# Altium schematic sheet ersa_schematics_analog.SchDoc: Ersa Module Analog
size A3; Author: Tomash Ghz; CompanyName: GHz Labs; DrawnBy: Tomash Ghz; Engineer: Tomash Ghz; Organization: GHz Labs; Address1: Tomash Ghz; Address2: Berlin 2019; Revision: 1.0; SheetNumber: 2; SheetTotal: 2; DocumentName: Ersa Module Analog; ProjectName: Ersa
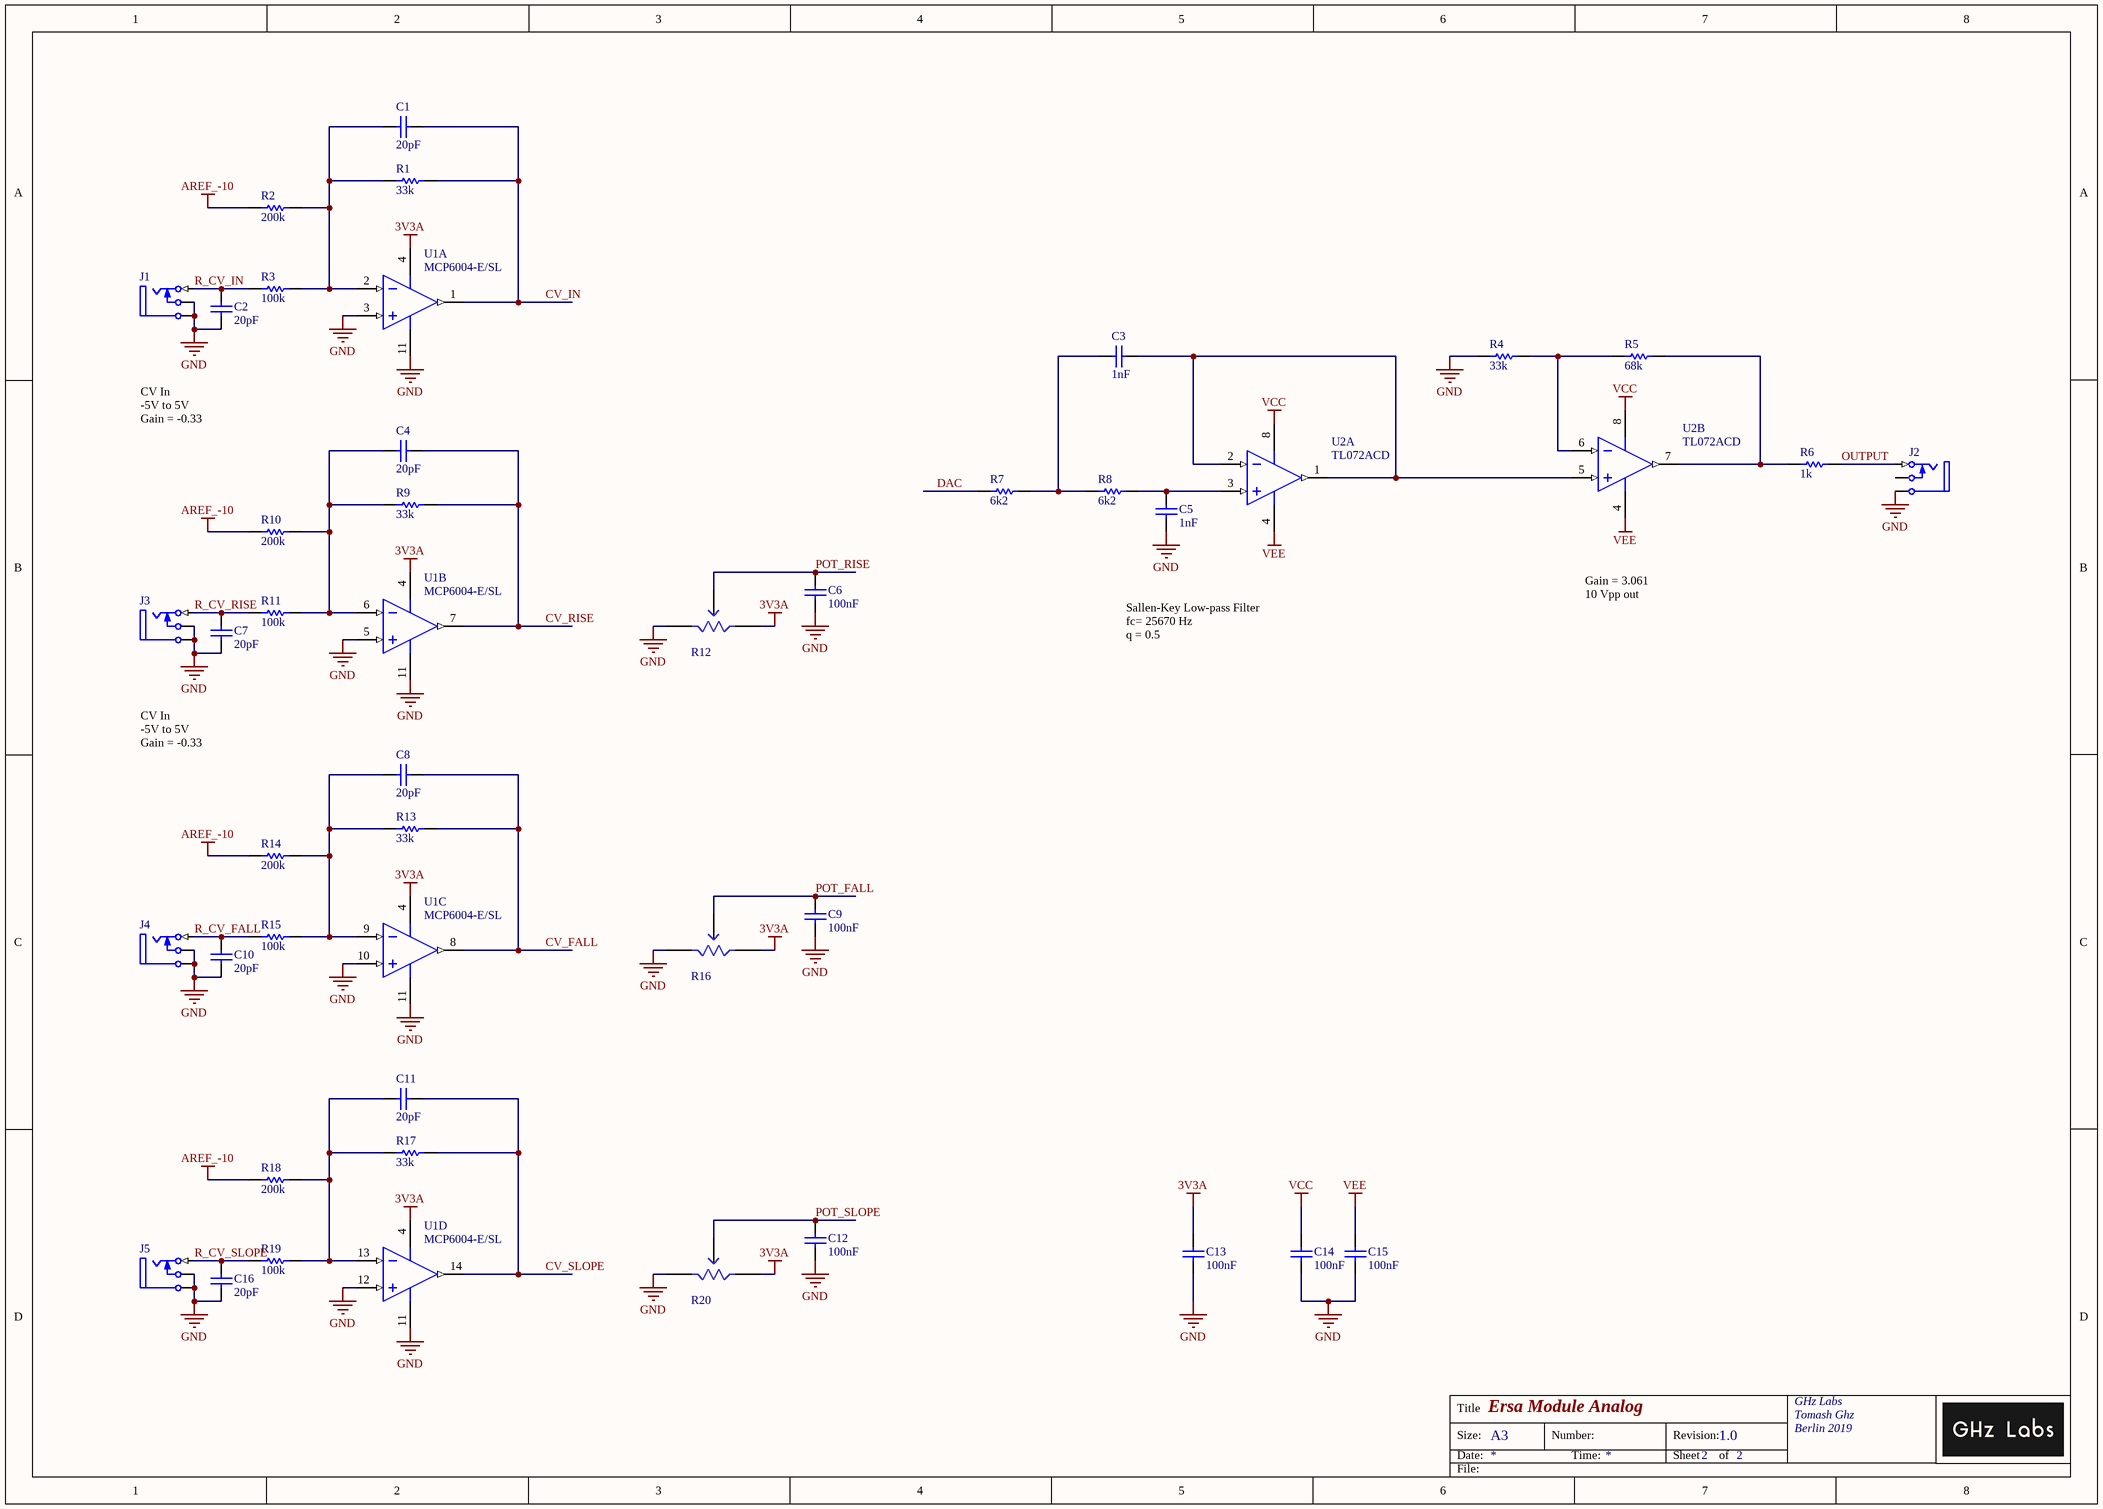
[diagram p0: ersa_schematics_analog.SchDoc]

## Parts
C1  20pF  [CAPA_0805]
C2  20pF  [CAPA_0805]
C3  1nF  [CAPA_0805]
C4  20pF  [CAPA_0805]
C5  1nF  [CAPA_0805]
C6  100nF  [CAPA_0805]
C7  20pF  [CAPA_0805]
C8  20pF  [CAPA_0805]
C9  100nF  [CAPA_0805]
C10  20pF  [CAPA_0805]
C11  20pF  [CAPA_0805]
C12  100nF  [CAPA_0805]
C13  100nF  [CAPA_0805]
C14  100nF  [CAPA_0805]
C15  100nF  [CAPA_0805]
C16  20pF  [CAPA_0805]
J1  Phonejack2 TN  [Thonkiconn]  (value not drawn)
J2  Phonejack2 TN  [Thonkiconn]  (value not drawn)
J3  Phonejack2 TN  [Thonkiconn]  (value not drawn)
J4  Phonejack2 TN  [Thonkiconn]  (value not drawn)
J5  Phonejack2 TN  [Thonkiconn]  (value not drawn)
R1  33k  [RES_0805]
R2  200k  [RES_0805]
R3  100k  [RES_0805]
R4  33k  [RES_0805]
R5  68k  [RES_0805]
R6  1k  [RES_0805]
R7  6k2  [RES_0805]
R8  6k2  [RES_0805]
R9  33k  [RES_0805]
R10  200k  [RES_0805]
R11  100k  [RES_0805]
R12  Potentiometer  [POT-ALPHA]  (value not drawn)
R13  33k  [RES_0805]
R14  200k  [RES_0805]
R15  100k  [RES_0805]
R16  Potentiometer  [POT-ALPHA]  (value not drawn)
R17  33k  [RES_0805]
R18  200k  [RES_0805]
R19  100k  [RES_0805]
R20  Potentiometer  [POT-ALPHA]  (value not drawn)
U1  MCP6004-E/SL  [SOIC-SL14_M]  (parts A,B,C,D of 4)
U2  TL072ACD  [D0008A_M]  (parts A,B of 2)

## Nets
3V3A: C13.1 R12.3 R16.3 R20.3 U1.4(VDD)
AREF_-10: R2.2 R10.2 R14.2 R18.2
GND: C2.1 C5.1 C6.2 C7.1 C9.2 C10.1 C12.2 C13.2 C14.2 C15.2 C16.1 J1.2(TN) J1.5(S) J2.5(S) J3.2(TN) J3.5(S) J4.2(TN) J4.5(S) J5.2(TN) J5.5(S) R4.2 R12.1 R16.1 R20.1 U1.3(VINA+) U1.5(VINB+) U1.10(VINC+) U1.11(VSS) U1.12(VIND+)
VCC: C14.1 U2.8(VCC+)
VEE: C15.1 U2.4(VCC-)
CV_FALL: C8.2 R13.1 U1.8(VOUTC)
CV_IN: C1.2 R1.1 U1.1(VOUTA)
CV_RISE: C4.2 R9.1 U1.7(VOUTB)
CV_SLOPE: C11.2 R17.1 U1.14(VOUTD)
DAC: R7.2
OUTPUT: J2.1(T) R6.1
POT_FALL: C9.1 R16.2
POT_RISE: C6.1 R12.2
POT_SLOPE: C12.1 R20.2
R_CV_FALL: C10.2 J4.1(T) R15.2
R_CV_IN: C2.2 J1.1(T) R3.2
R_CV_RISE: C7.2 J3.1(T) R11.2
R_CV_SLOPE: C16.2 J5.1(T) R19.2
NetC1_1: C1.1 R1.2 R2.1 R3.1 U1.2(VINA-)
NetC3_1: C3.1 R7.1 R8.2
NetC3_2: C3.2 U2.1(OUT1) U2.2(IN1-) U2.5(IN2+)
NetC4_1: C4.1 R9.2 R10.1 R11.1 U1.6(VINB-)
NetC5_2: C5.2 R8.1 U2.3(IN1+)
NetC8_1: C8.1 R13.2 R14.1 R15.1 U1.9(VINC-)
NetC11_1: C11.1 R17.2 R18.1 R19.1 U1.13(VIND-)
NetR4_1: R4.1 R5.2 U2.6(IN2-)
NetR5_1: R5.1 R6.2 U2.7(OUT2)

Not connected (* = marked no-connect by the designer): J2 2(TN)

## Notes on the sheet
- CV In
  -5V to 5V
  Gain = -0.33
- Sallen-Key Low-pass Filter
  fc= 25670 Hz
  q = 0.5
- Gain = 3.061
  10 Vpp out
- Title
- Size:
- Date:
- A3
- Number:
- Time:
- Revision:
- Sheet
- of
- File:

## Library data of the parts
C1-C16 = Cap: Capacitor; Published: 8-Jun-2000; LatestRevisionDate: 17-Jul-2002; LatestRevisionNote: Re-released for DXP Platform.; PackageReference: RAD-0.3; Publisher: Altium Limited; PackageDescription: Radial Cap, Thru-Hole; 2 Leads; 0.3 in Pin Spacing
  C1 C2 C4 C7 C8 C10 C11 C16: Value: 20pF
  C3 C5: Value: 1nF
  C6 C9 C12-C15: Value: 100nF
J1-J5 = Phonejack2 TN: Jack Socket; Part: ACJM-MV35-2S; Manufacturer: Amphenol Audio; Mouser: http://www.mouser.de/ProductDetail/Amphenol/ACJM-MV35-2S/?qs=%2fha2pyFaduh8uNgKuHZ7oEtHXwcSE0WAH4R1pjDPuhAHZsUXTeJRNg%3d%3d; Datasheet: http://www.amphenolaudio.com/wp-content/uploads/2015/07/55010544-001-rev-2.pdf; Thonk: https://www.thonk.co.uk/shop/3-5mm-jacks/
R1 R4 R9 R13 R17 = Resistor: 33k 0805; PartNumber: RR1220P-105-D; Manufacturer: Susumu; Value: 33k; Mouser: http://www.mouser.de/ProductDetail/Susumu/RR1220P-105-D/?qs=sGAEpiMZZMu61qfTUdNhG%2fDhcyQpRg8MxiYDTLm9lx4%3d
R2 R10 R14 R18 = Resistor: 200k 0805; PartNumber: RR1220P-105-D; Manufacturer: Susumu; Value: 200k; Mouser: http://www.mouser.de/ProductDetail/Susumu/RR1220P-105-D/?qs=sGAEpiMZZMu61qfTUdNhG%2fDhcyQpRg8MxiYDTLm9lx4%3d
R3 R11 R15 R19 = Resistor: 100k 0805; PartNumber: RR1220P-105-D; Manufacturer: Susumu; Value: 100k; Mouser: http://www.mouser.de/ProductDetail/Susumu/RR1220P-105-D/?qs=sGAEpiMZZMu61qfTUdNhG%2fDhcyQpRg8MxiYDTLm9lx4%3d
R5 = Resistor: 68k 0805; PartNumber: RR1220P-105-D; Manufacturer: Susumu; Value: 68k; Mouser: http://www.mouser.de/ProductDetail/Susumu/RR1220P-105-D/?qs=sGAEpiMZZMu61qfTUdNhG%2fDhcyQpRg8MxiYDTLm9lx4%3d
R6 = Resistor: 1k 0805; PartNumber: RR1220P-105-D; Manufacturer: Susumu; Value: 1k; Mouser: http://www.mouser.de/ProductDetail/Susumu/RR1220P-105-D/?qs=sGAEpiMZZMu61qfTUdNhG%2fDhcyQpRg8MxiYDTLm9lx4%3d
R7 R8 = Resistor: 6k2 0805; PartNumber: RR1220P-105-D; Manufacturer: Susumu; Value: 6k2; Mouser: http://www.mouser.de/ProductDetail/Susumu/RR1220P-105-D/?qs=sGAEpiMZZMu61qfTUdNhG%2fDhcyQpRg8MxiYDTLm9lx4%3d
R12 R16 R20 = Potentiometer: PartNumber: PTV09A-4020U-B104; Mouser: http://www.mouser.de/Search/ProductDetail.aspx?R=PTV09A-4020U-B104virtualkey65210000virtualkey652-PTV09A4020U-B104
U1 = MCP6004-E/SL: 1 MHz, Low-Power Operational Amplifier, 14-Pin SOIC, Extended Temperature; PartNumber: MCP6004T-E/SL; Manufacturer: Microchip Technology; Published: 29-Jan-2009; LatestRevisionDate: 02-Dec-2009; LatestRevisionNote: Updated to datasheet revision J, Nov-2009; DatasheetVersion: revJ, Nov-2009; PackageVersion: revBB, Aug-2009; PackageReference: SOIC-SL14; Publisher: Altium Limited; PackageDescription: 14-Lead Plastic Small Outline (SL) - Narrow, 3.90mm Body [SOIC]; Supplier 1: Digi-Key; Supplier Part Number 1: MCP6004-E/SL-ND; Supplier 2: Farnell; Supplier Part Number 2: 1332122; Code_JEDEC: MS-012-AB; Code_IPC: SOIC127P600-14; ComponentLink1Description: Datasheet; ComponentLink1URL: http://ww1.microchip.com/downloads/en/DeviceDoc/21733j.pdf; ComponentLink2Description: Packaging Specification; ComponentLink2URL: http://www.microchip.com/stellent/groups/techpub_sg/documents/packagingspec/en012702.pdf; ComponentLink3Description: Microchip.com Home; ComponentLink3URL: http://www.microchip.com/; Mouser: http://www.mouser.de/ProductDetail/Microchip-Technology/MCP6004T-E-SL/?qs=sGAEpiMZZMtCHixnSjNA6N5WMYiF%252b1miedbE5%2f40CfM%3d
U2 = CMP-0015-00092-2: Low-Noise JFET-Input Operational Amplifier, 7 to 36 V, 0 to 70 degC, 8-pin SOIC (D8), Green (RoHS & no Sb/Br); Manufacturer: Texas Instruments; Iq per channel(Max)(mA): 2.5; Total Supply Voltage(Max)(+5V is 5, +/-5V is 10): 36; Total Supply Voltage(Min)(+5V is 5, +/-5V is 10): 7; GBW(Typ)(MHz): 3; Sub Family: General Purpose Amplifier, High Supply Voltage Amplifier (>=30V); Number of Channels: 2; CMRR(Min)(dB): 75; Vn at 1kHz(Typ)(nV/rtHz): 18; Vio (25C)(Max)(mV): 6; Rating: Catalog; Slew Rate(Typ)(V/us): 13; IIB(Max)(pA): 200; PartNumber: TL072ACD; ComponentLink3Description: Package Specification; PackageDescription: 8-Pin Plastic Small Outline, Body 4.9 x 3.9 mm, Pitch 1.27 mm; ComponentLink1Description: Manufacturer URL; PackageVersion: 4040047-3/M, 06/2011; ComponentLink1URL: http://www.ti.com/; Code_JEDEC: MS-012; Mounting Technology: Surface Mount; ComponentLink3URL: http://www.ti.com/litv/pdf/msoi002j; ComponentLink2Description: Datasheet; Offset Drift(Typ)(uV/C): 18; PackageReference: D0008A; DatasheetVersion: SLOS080J; ComponentLink2URL: http://www.ti.com/lit/ds/symlink/tl072a.pdf; Eco-Plan: Green (RoHS & no Sb/Br)